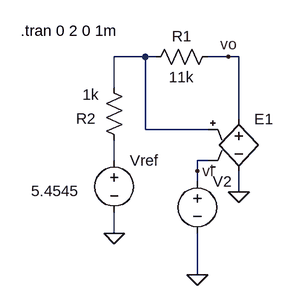
[diagram p0: schematic comparadores3.asc]
comparadores3.asc, the LTspice schematic file:
Version 4
SHEET 1 1884 820
WIRE 48 160 0 160
WIRE 64 160 48 160
WIRE 176 160 144 160
WIRE 192 160 176 160
WIRE 0 208 0 160
WIRE 192 256 192 160
WIRE 48 272 48 160
WIRE 144 272 48 272
WIRE 0 320 0 288
WIRE 144 320 128 320
WIRE 128 336 128 320
WIRE 128 352 128 336
WIRE 192 368 192 336
WIRE 0 432 0 400
WIRE 128 496 128 432
FLAG 0 432 0
FLAG 128 496 0
FLAG 192 368 0
FLAG 128 336 vi
FLAG 176 160 vo
SYMBOL e 192 240 R0
WINDOW 3 24 96 Invisible 2
SYMATTR Value (-100,-12)(-.6u,-12)(.6u,12)(100,12)
SYMATTR InstName E1
SYMATTR SpiceModel table
SYMBOL res 160 144 R90
WINDOW 0 0 56 VBottom 2
WINDOW 3 32 56 VTop 2
SYMATTR InstName R1
SYMATTR Value 11k
SYMBOL res -16 192 R0
WINDOW 0 -43 63 Left 2
WINDOW 3 -33 26 Left 2
SYMATTR InstName R2
SYMATTR Value 1k
SYMBOL voltage 0 304 R0
WINDOW 3 -128 63 Left 2
WINDOW 123 0 0 Left 2
WINDOW 39 0 0 Left 2
SYMATTR InstName Vref
SYMATTR Value 5.4545
SYMBOL voltage 128 336 R0
WINDOW 3 24 96 Invisible 2
WINDOW 123 0 0 Left 2
WINDOW 39 0 0 Left 2
SYMATTR InstName V2
SYMATTR Value PULSE(0 12 0 1 1 .001 2.001)
TEXT -144 120 Left 2 !.tran 0 2 0 1m

The netlist it stands for:
* comparadores3.asc
E1 vo 0 N001 vi table (-100,-12)(-.6u,-12)(.6u,12)(100,12)
R1 vo N001 11k
R2 N001 N002 1k
Vref N002 0 5.4545
V2 vi 0 PULSE(0 12 0 1 1 .001 2.001)
.tran 0 2 0 1m
.backanno
.end